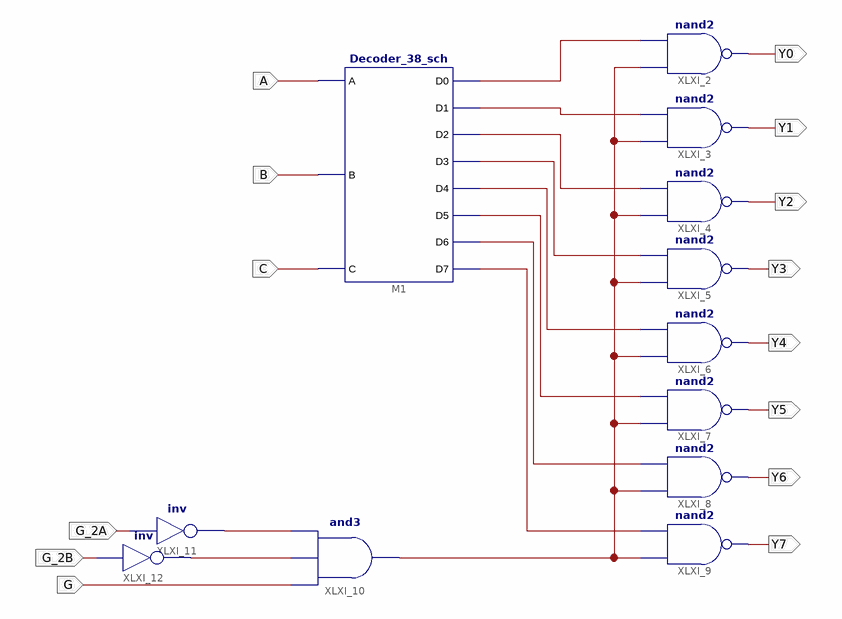
[diagram p0: schematic sheet 1]
// Xilinx ISE schematic HCT138_sch.sch (kintex7) as structural Verilog: 12 symbols, 14 ports
module HCT138_sch (
  input  A,
  input  B,
  input  C,
  input  G,
  input  G_2B,
  input  G_2A,
  output Y0,
  output Y1,
  output Y2,
  output Y3,
  output Y4,
  output Y5,
  output Y6,
  output Y7
);

  wire XLXN_4, XLXN_5, XLXN_6, XLXN_7, XLXN_8, XLXN_9, XLXN_10, XLXN_11, XLXN_12, XLXN_13, XLXN_18;

  Decoder_38_sch M1 (
    .A(A), .B(B), .C(C), .D0(XLXN_4), .D1(XLXN_5), .D2(XLXN_6), .D3(XLXN_7), .D4(XLXN_8), .D5(XLXN_9),
    .D6(XLXN_10), .D7(XLXN_11));
  nand XLXI_2 (Y0, XLXN_18, XLXN_4);
  nand XLXI_3 (Y1, XLXN_18, XLXN_5);
  nand XLXI_4 (Y2, XLXN_18, XLXN_6);
  nand XLXI_5 (Y3, XLXN_18, XLXN_7);
  nand XLXI_6 (Y4, XLXN_18, XLXN_8);
  nand XLXI_7 (Y5, XLXN_18, XLXN_9);
  nand XLXI_8 (Y6, XLXN_18, XLXN_10);
  nand XLXI_9 (Y7, XLXN_18, XLXN_11);
  and XLXI_10 (XLXN_18, G, XLXN_13, XLXN_12);
  not XLXI_11 (XLXN_12, G_2A);
  not XLXI_12 (XLXN_13, G_2B);
endmodule
